# Altium schematic sheet rfm.SchDoc
size A; SheetNumber: 3; SheetTotal: 3
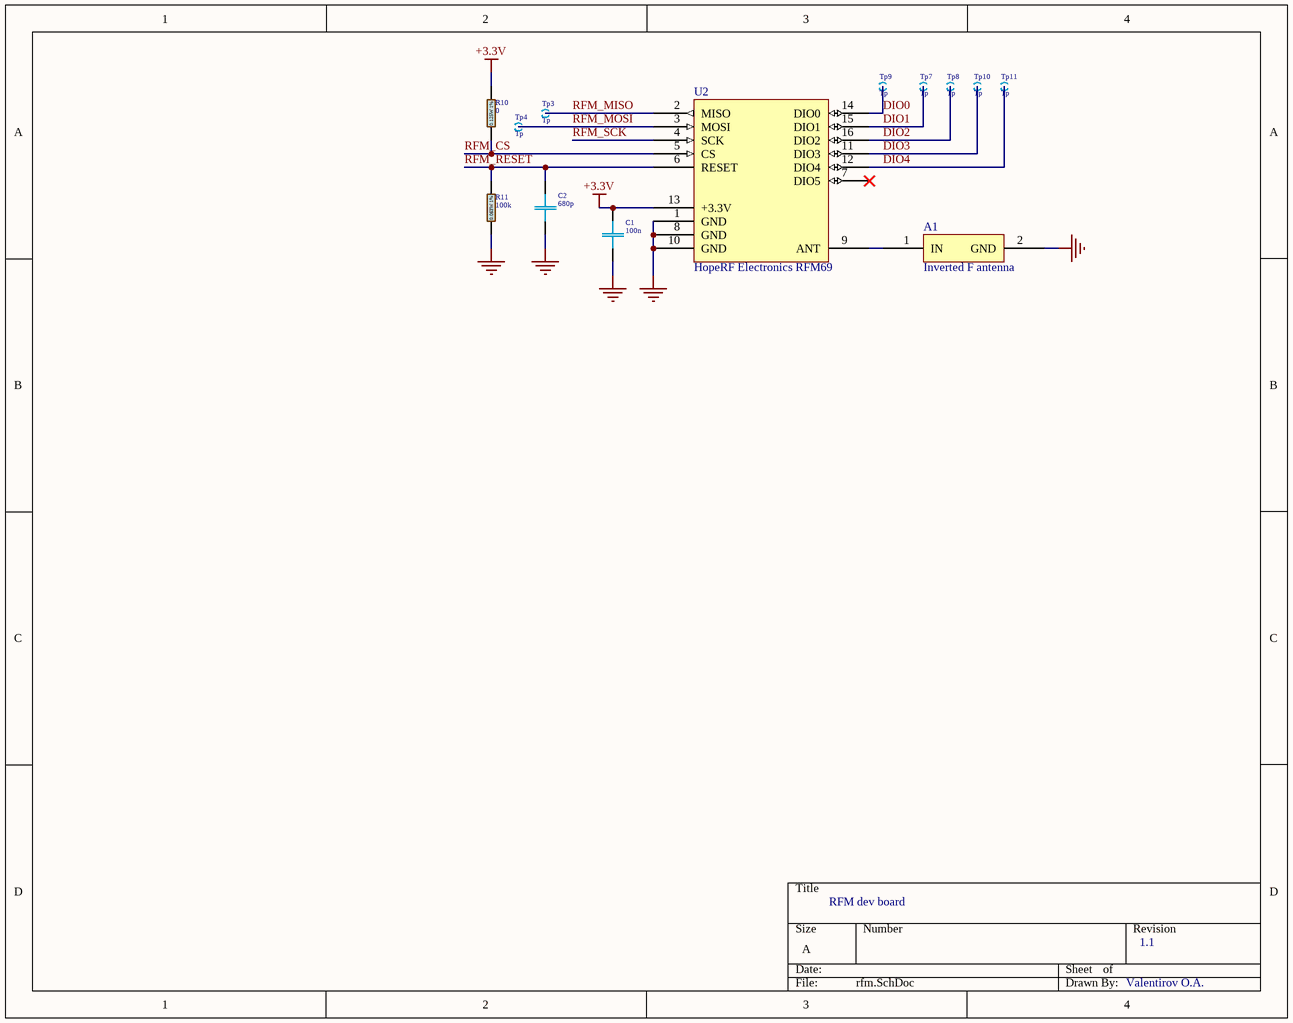
[diagram p0: rfm.SchDoc]

## Parts
A1  Inverted F antenna  [Invertef_F-footprint]  (net tie, no BOM)
C1  100n  [C 0402(1005)x0.5]
C2  680p  [C 0402(1005)x0.5]
R10  0  [R 0805(2012)-1%]
R11  100k  [R 0402(1005)-1%]
Tp3  Tp  [Tp-0.5]  (no BOM)
Tp4  Tp  [Tp-0.5]  (no BOM)
Tp7  Tp  [Tp-0.5]  (no BOM)
Tp8  Tp  [Tp-0.5]  (no BOM)
Tp9  Tp  [Tp-0.5]  (no BOM)
Tp10  Tp  [Tp-0.5]  (no BOM)
Tp11  Tp  [Tp-0.5]  (no BOM)
U2  HopeRF Electronics RFM69  [CAC-200P1600X1600-16N]

## Nets
+3.3V: C1.1 R10.2 U2.13(+3.3V)
GND: A1.2(GND) C1.2 C2.2 R11.1 U2.1(GND) U2.8(GND) U2.10(GND)
DIO0: Tp9.1 U2.14(DIO0)
DIO1: Tp7.1 U2.15(DIO1)
DIO2: Tp8.1 U2.16(DIO2)
DIO3: Tp10.1 U2.11(DIO3)
DIO4: Tp11.1 U2.12(DIO4)
RFM_CS: R10.1 U2.5(CS)
RFM_MISO: Tp3.1 U2.2(MISO)
RFM_MOSI: Tp4.1 U2.3(MOSI)
RFM_RESET: C2.1 R11.2 U2.6(RESET)
RFM_SCK: U2.4(SCK)
NetA1_1: A1.1(IN) U2.9(ANT)

Not connected (* = marked no-connect by the designer): U2 7(DIO5)*

## Notes on the sheet
- RFM dev board
- 1.1
- Valentirov O.A.
- (in symbol R 0402-1%) 0.063W 1%
- (in symbol R 0805-1%) 0.125W 1%

## Library data of the parts
A1 = inverted_F
C1 C2 = C 0402    16V X5R - 0*: SMD 0402     16V X5R 10%; Manufacturer: Samsung; TYPE: Capacitors; Tolerance %: ±20%; Package-mm: 1005; Part Number: *; Mount Type: SMT; Publisher: Hefest; Manufacturer Alternate: *; Part Number Alternate: *; Published: 07.04.2019; Supplier 1: Comet; Supplier Part Number 1: *; RoHS: Y; Technology: Ceramic  MLCC; Package: 0402; VDC: 16V; TempCo: X5R; VAC: *; ESR Ohm: *; ComponentLink1Description: Datasheet Link; ComponentLink1URL: https://store.comet.bg/download-file.php?id=11; Temperature Range: -55°C ~ +85°C; Price: *
  C1: Value: 100n
  C2: Value: 680p
R10 = R 0805-1%: SMD 0805 0.125W 1% 150V; Manufacturer: YAGEO; TempCo: ±100ppm/°C; Package-mm: 2012; Value Code: 1001; Part Number: *; Mount Type: SMT; Publisher: Hefest; Manufacturer Alternate: *; Published: 07.04.2019; Supplier 1: Comet; Supplier Part Number 1: R0805 1.0K 1% YAG/ASJ; RoHS: Y; Technology: Thick film; Package: 0805; VDC: 150V; Tolerance %: ±1%; ComponentLink1Description: Datasheet Link; ComponentLink1URL: https://store.comet.bg/download-file.php?id=1224; Temperature Range: -55°C ~ +155°C; Price: 0.031; Part Number Alternate: *; TYPE: Resistor; Power: 0.125W; Value: 0
R11 = R 0402-1%: SMD 0402 0.063W 1%   50V; Manufacturer: YAGEO; TempCo: ±100ppm/°C; Package-mm: 1005; Value Code: 1001; Power: 0.0625W; Part Number: *; Mount Type: SMT; Publisher: Hefest; Manufacturer Alternate: *; Published: 07.04.2019; Supplier 1: Comet; Supplier Part Number 1: R0402 1.0K 1% YAG/ASJ; RoHS: Y; Technology: Thick film; Package: 0402; VDC: 50V; Tolerance %: ±1%; ComponentLink1Description: Datasheet Link; ComponentLink1URL: https://store.comet.bg/download-file.php?id=1224; Temperature Range: -55°C ~ +155°C; Price: 0.015; Part Number Alternate: *; TYPE: Resistor; Value: 100k
Tp3 Tp4 Tp7-Tp11 = Tp: TestPoint; TYPE: TestPoint; Technology: PCB; Mount Type: SMT; Package: TestPoint; Published: 07.04.2019; Publisher: Hefest; Value: Tp
U2 = RFM69